# EAGLE schematic p0-001 (EAGLE 9.5.2)
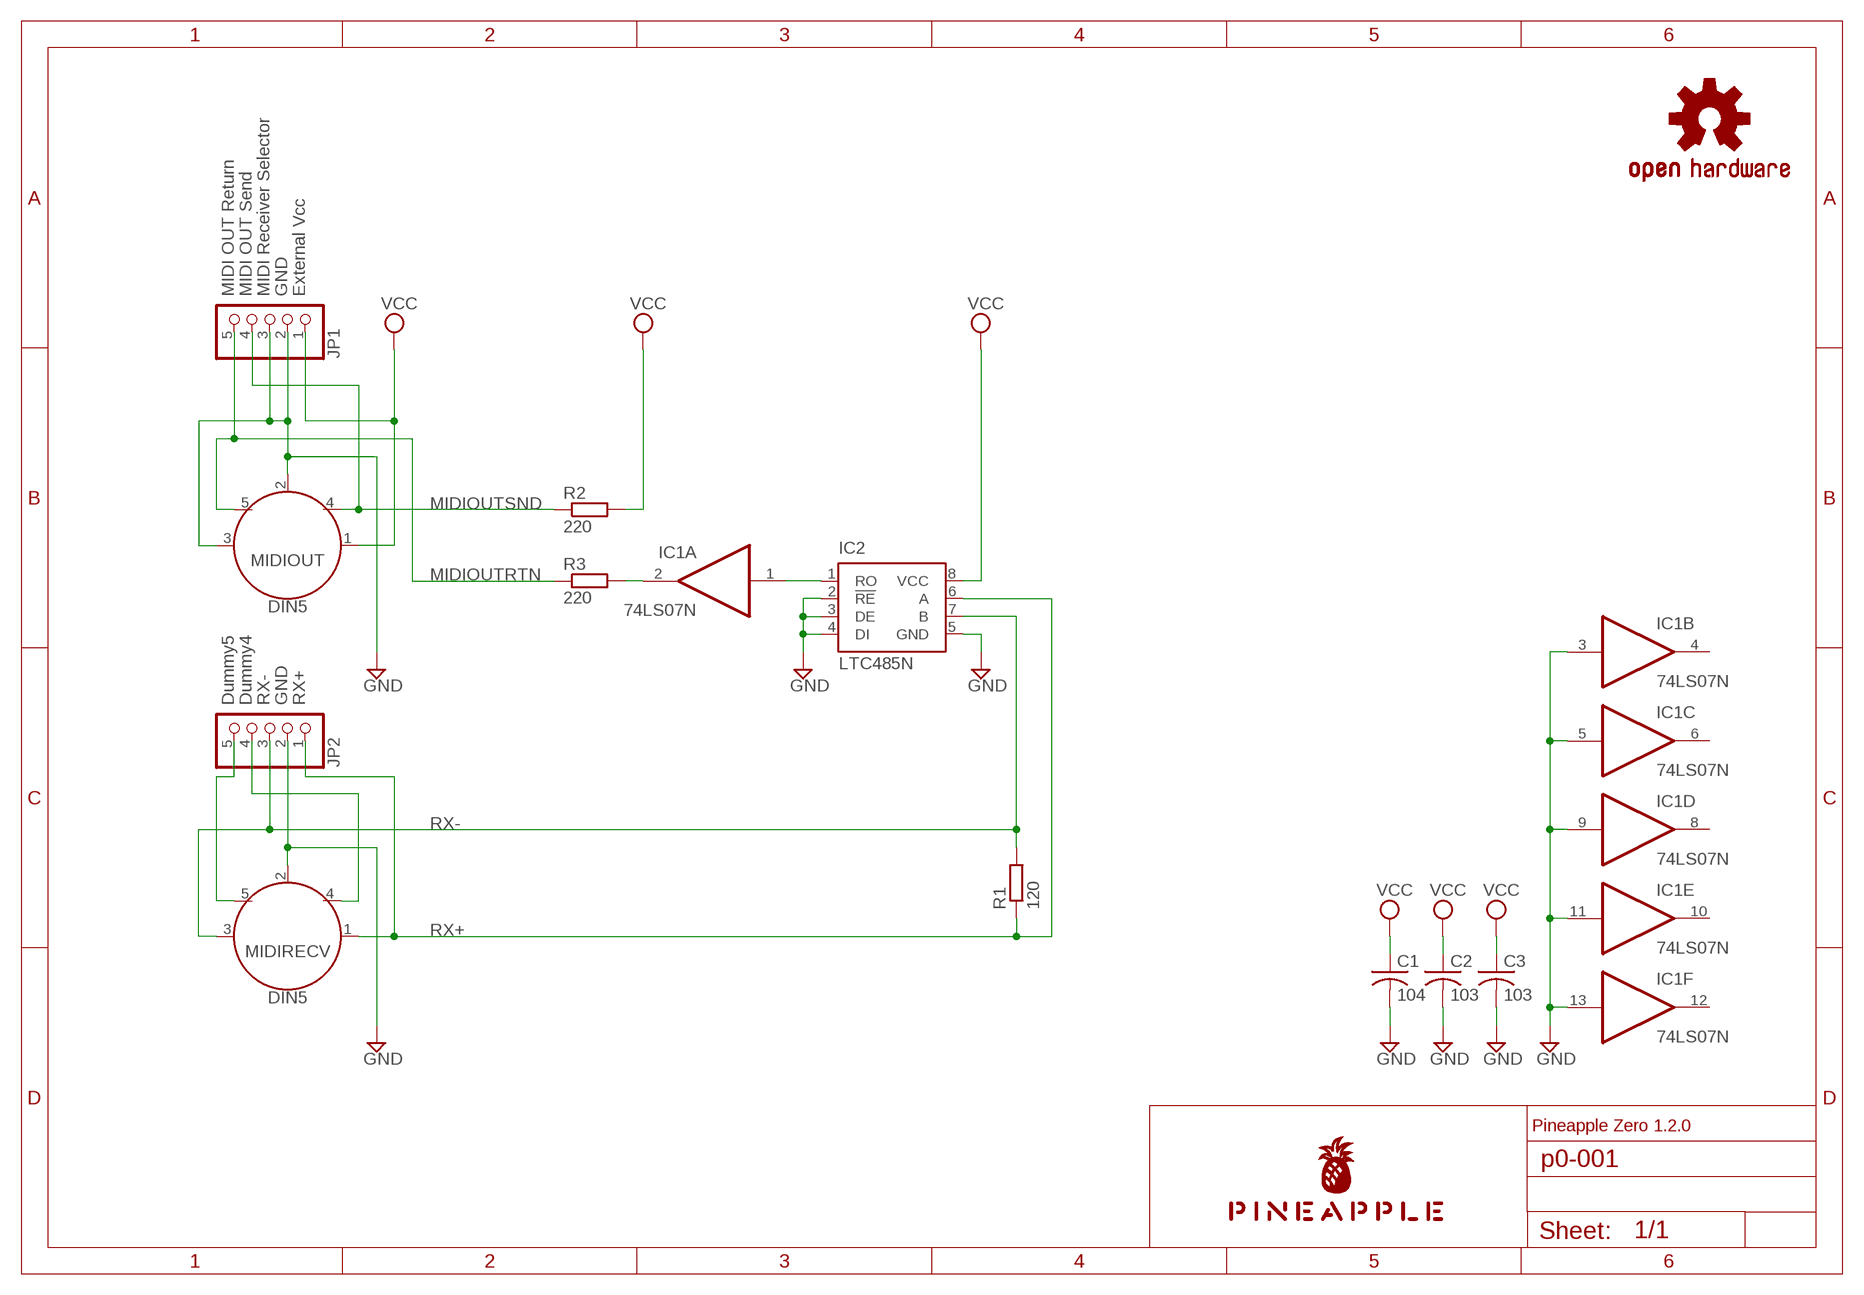
[diagram p0: schematic, sheet 1]

## Parts
C1  104  C-US025-025X050  [C025-025X050]
C2  103  C-US025-025X050  [C025-025X050]
C3  103  C-US025-025X050  [C025-025X050]
IC1  74LS07N  [DIL14]
IC2  LTC485N  [DIL08]
JP1  PINHD-1X5  [1X05]
JP2  PINHD-1X5  [1X05]
LOGO1  OSHW-LOGOS-COPPER  [OSHW-LOGO-S_COPPER]
MIDIOUT  DIN5  [DIN5-RA-PTH]
MIDIRECV  DIN5  [DIN5-RA-PTH]
R1  120  R-EU_0204/5  [0204/5]
R2  220  R-EU_0204/5  [0204/5]
R3  220  R-EU_0204/5  [0204/5]
U$1  PINEAPPLE450  [PINEAPPLE450]

## Nets
DUMMY4: JP2.4 MIDIRECV.4
DUMMY5: JP2.5 MIDIRECV.5
GND [power]: C1.2 C2.2 C3.2 IC1.3(B:I) IC1.5(C:I) IC1.9(D:I) IC1.11(E:I) IC1.13(F:I) IC2.2(!RE) IC2.3(DE) IC2.4(DI) IC2.5(GND) JP1.2 JP1.3 JP2.2 MIDIOUT.2 MIDIOUT.3 MIDIRECV.2
MIDIOUTRTN: JP1.5 MIDIOUT.5 R3.1
MIDIOUTSND: JP1.4 MIDIOUT.4 R2.1
N$1: IC1.2(A:O) R3.2
RX+: IC2.6(A) JP2.1 MIDIRECV.1 R1.1
RX-: IC2.7(B) JP2.3 MIDIRECV.3 R1.2
TX: IC1.1(A:I) IC2.1(RO)
VCC [power]: C1.1 C2.1 C3.1 IC2.8(VCC) JP1.1 MIDIOUT.1 R2.2
Unconnected: IC1.4(B:O) IC1.6(C:O) IC1.8(D:O) IC1.10(E:O) IC1.12(F:O)

## Notes on the sheet
- MIDI OUT Return | MIDI OUT Send | MIDI Receiver Selector | GND | External Vcc
- Dummy5 | Dummy4 | RX- | GND | RX+
- Pineapple Zero 1.2.0

## Power pins joined to a net without a drawn wire
GND: IC1.7(P:GND)
VCC: IC1.14(P:VCC)

## Library data of the parts
C1-C3 = rcl:C-US: CAPACITOR, American symbol; SPICEPREFIX: C
IC1 = 74xx-us:74*07: Hex BUFFER, open collector high-voltage output
IC2 = linear-technology:LTC485: Low Power RS485 Interface Transceiver Source: http://www.linear.com/pc/downloadDocument.do?navId=H0,C1,C1007,C1017,P2064,D1718; OC_FARNELL: unknown; OC_NEWARK: unknown
JP1 JP2 = pinhead:PINHD-1X5: PIN HEADER
LOGO1 = SparkFun-Aesthetics:OSHW-LOGO: Open-Source Hardware (OSHW) Logo This logo indicates the piece of hardware it is found on incorporates a OSHW license and/or adheres to the definition of open source hardware found here: http://freedomdefined.org/OSHW
MIDIOUT MIDIRECV = SparkFun-Connectors:DIN5: DIN5 Connector - Female Right Angle (frequently used as a MIDI Jack connector) This type of connector and cable is frequently used for transmitting midi data (musical instrument digital interface). It is what you usually see on a keyboard or set of electronic drums. Learn more here <https://en.wikipedia.org/wiki/MIDI>. For more information on the pinout and electrical specifications of MIDI communications, please see the following resource: https://www.midi.org/specifications/item/midi-din-electrical-specification Here is the connector we sell at SparkFun: MIDI Connector - Female Right Angle <https://www.sparkfun.com/products/9536> (PRT-09536) Datasheet <hhttp://www.sparkfun.com/datasheets/Prototyping/Connectors/MIDI-RA.pdf> It is used on this SparkFun product: SparkFun MIDI Shield <https://www.sparkfun.com/products/12898> (DEV-12898); PROD_ID: CONN-09481
R1-R3 = resistor:R-EU_: RESISTOR, European symbol
U$1 = pineapple:PINEAPPLE450

## Net classes
0 default: width 0.152 mm, drill 0.152 mm, clearance 0.152 mm
1 power: width 0.305 mm, drill 0.152 mm, clearance 0.152 mm to class 0, clearance 0.152 mm